# Altium project PLWD_Schematics.PrjPcb (part 1 of 3)
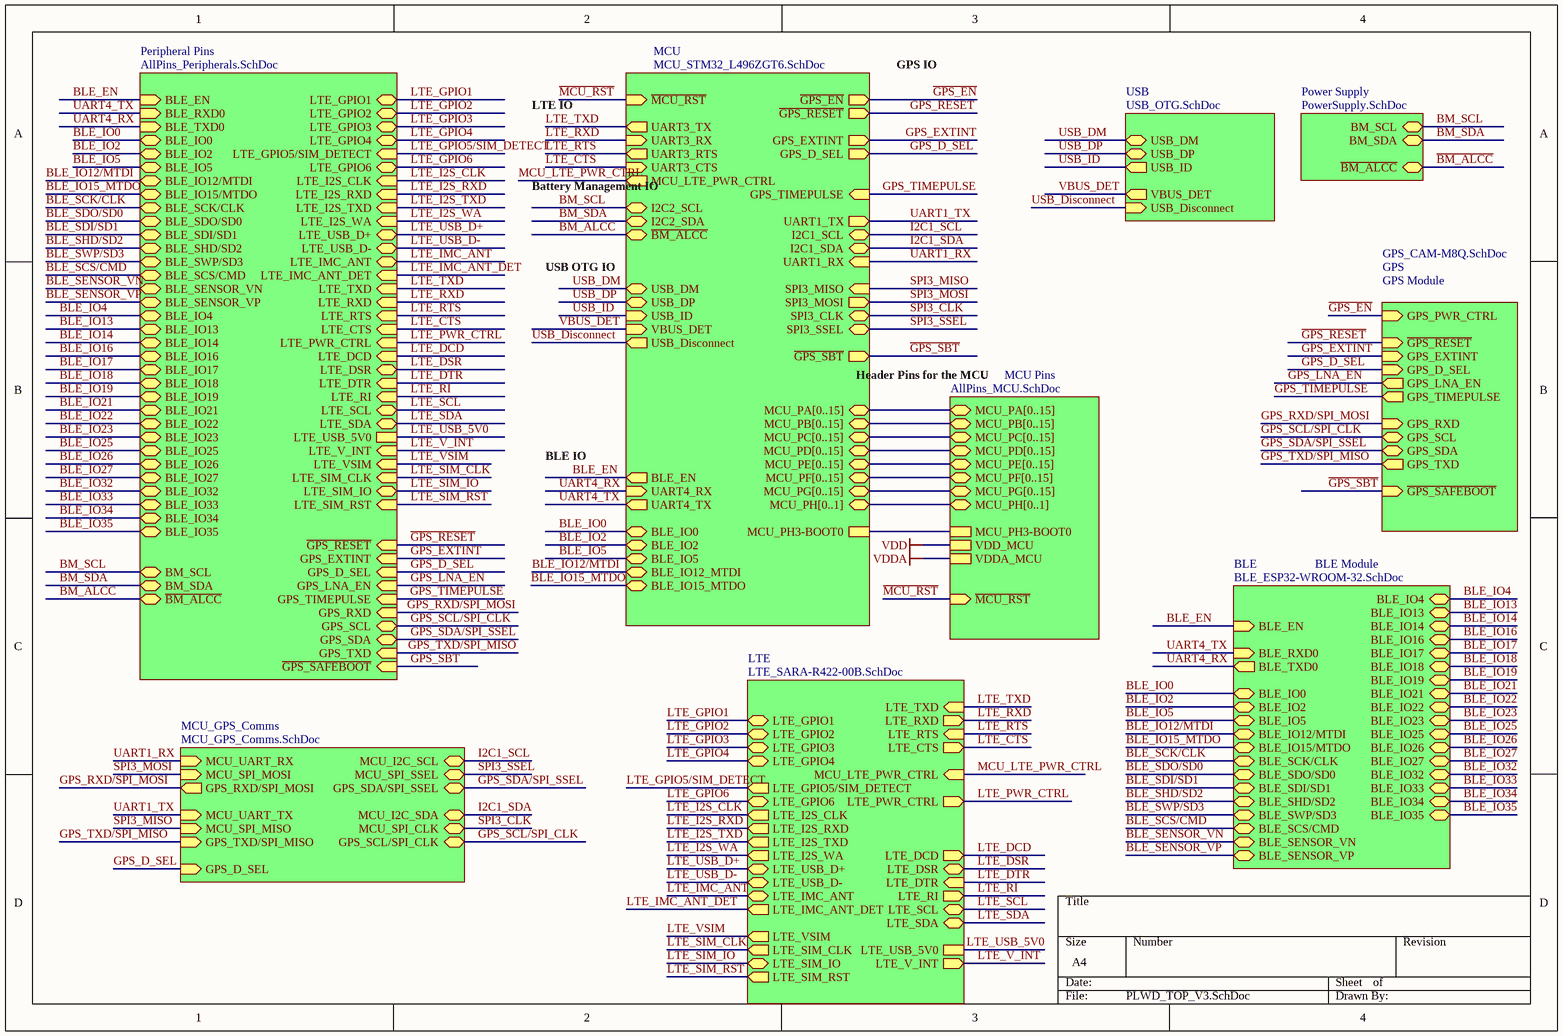
[diagram p0: PLWD_TOP_V3.SchDoc]
10 sheets, 146 parts. Net scope: hierarchical (ports join the sheet entries above them; power ports are global).
Board file: PLWD_PCB_6Layer.PcbDoc
Sheets:
  PLWD_TOP_V3.SchDoc
    MCU = MCU_STM32_L496ZGT6.SchDoc
    LTE = LTE_SARA-R422-00B.SchDoc
    GPS = GPS_CAM-M8Q.SchDoc
    BLE = BLE_ESP32-WROOM-32.SchDoc
    Power Supply = PowerSupply.SchDoc
    Peripheral Pins = AllPins_Peripherals.SchDoc
    MCU Pins = AllPins_MCU.SchDoc
    MCU_GPS_Comms = MCU_GPS_Comms.SchDoc
    USB = USB_OTG.SchDoc

## Sheet PLWD_TOP_V3.SchDoc
size A4; SheetNumber: 1; SheetTotal: 10

### Sub-sheets
BLE = BLE_ESP32-WROOM-32.SchDoc: BLE_EN (in), BLE_RXD0 (in), BLE_TXD0 (out), BLE_IO0 (bidir), BLE_IO2 (bidir), BLE_IO5 (bidir), BLE_IO12/MTDI (bidir), BLE_IO15/MTDO (bidir), BLE_SCK/CLK (bidir), BLE_SDO/SD0 (bidir), BLE_SDI/SD1 (bidir), BLE_SHD/SD2 (bidir), BLE_SWP/SD3 (bidir), BLE_SCS/CMD (bidir), BLE_SENSOR_VN (bidir), BLE_SENSOR_VP (bidir), BLE_IO4 (bidir), BLE_IO13 (bidir), BLE_IO14 (bidir), BLE_IO16 (bidir), BLE_IO17 (bidir), BLE_IO18 (bidir), BLE_IO27 (bidir), BLE_IO26 (bidir), BLE_IO25 (bidir), BLE_IO23 (bidir), BLE_IO22 (bidir), BLE_IO21 (bidir), BLE_IO19 (bidir), BLE_IO32 (bidir), BLE_IO33 (bidir), BLE_IO34 (bidir), BLE_IO35 (bidir)
GPS = GPS_CAM-M8Q.SchDoc: GPS_PWR_CTRL (in), ~{GPS_RESET} (in), GPS_EXTINT (in), GPS_D_SEL (in), GPS_LNA_EN (out), GPS_TIMEPULSE (out), GPS_RXD (in), GPS_SCL (bidir), GPS_SDA (bidir), GPS_TXD (out), ~{GPS_SAFEBOOT} (in)
LTE = LTE_SARA-R422-00B.SchDoc: LTE_TXD (in), LTE_RXD (out), LTE_RTS (in), LTE_CTS (out), MCU_LTE_PWR_CTRL (in), LTE_GPIO1 (bidir), LTE_GPIO2 (bidir), LTE_GPIO3 (bidir), LTE_GPIO4 (bidir), LTE_GPIO5/SIM_DETECT (out), LTE_GPIO6 (bidir), LTE_I2S_CLK (out), LTE_I2S_RXD (out), LTE_I2S_TXD (out), LTE_I2S_WA (out), LTE_USB_D- (bidir), LTE_USB_D+ (bidir), LTE_IMC_ANT (bidir), LTE_IMC_ANT_DET (out), LTE_DTR (in), LTE_DSR (bidir), LTE_DCD (out), LTE_RI (out), LTE_SDA (bidir), LTE_SCL (bidir), LTE_USB_5V0, LTE_V_INT (out), LTE_VSIM (out), LTE_SIM_CLK (out), LTE_SIM_IO (bidir), LTE_SIM_RST (out), LTE_PWR_CTRL (out)
MCU = MCU_STM32_L496ZGT6.SchDoc: UART3_TX (out), UART3_RX (in), UART3_RTS (out), UART3_CTS (in), I2C2_SCL (bidir), I2C2_SDA (bidir), MCU_LTE_PWR_CTRL (out), ~{GPS_SBT} (out), UART1_TX (out), UART1_RX (in), GPS_EXTINT (out), I2C1_SCL (bidir), I2C1_SDA (bidir), GPS_TIMEPULSE (in), GPS_D_SEL (out), UART4_RX (in), UART4_TX (out), BLE_IO0 (bidir), BLE_IO2 (bidir), BLE_IO5 (bidir), BLE_IO12_MTDI (bidir), BLE_IO15_MTDO (bidir), ~{BM_ALCC} (bidir), ~{GPS_RESET} (out), BLE_EN (out), ~{GPS_EN} (out), SPI3_MISO (in), SPI3_MOSI (out), SPI3_CLK (bidir), SPI3_SSEL (bidir), USB_DM (bidir), USB_DP (bidir), MCU_PA[0..15] (bidir), MCU_PB[0..15] (bidir), MCU_PC[0..15] (bidir), MCU_PD[0..15] (bidir), MCU_PE[0..15] (bidir), MCU_PF[0..15] (bidir), MCU_PG[0..15] (bidir), MCU_PH3-BOOT0, MCU_PH[0..1] (bidir), ~{MCU_RST} (in), USB_ID (in), VBUS_DET (in), USB_Disconnect (out)
MCU Pins = AllPins_MCU.SchDoc: MCU_PA[0..15] (bidir), MCU_PB[0..15] (bidir), MCU_PC[0..15] (bidir), MCU_PD[0..15] (bidir), MCU_PE[0..15] (bidir), MCU_PF[0..15] (bidir), MCU_PG[0..15] (bidir), MCU_PH[0..1] (bidir), MCU_PH3-BOOT0, VDD_MCU, VDDA_MCU, ~{MCU_RST} (in)
MCU_GPS_Comms = MCU_GPS_Comms.SchDoc: MCU_UART_RX (in), MCU_SPI_MOSI (in), GPS_D_SEL (in), GPS_RXD/SPI_MOSI (out), MCU_UART_TX (in), MCU_SPI_MISO (in), GPS_TXD/SPI_MISO (in), GPS_SDA/SPI_SSEL (bidir), MCU_SPI_SSEL (bidir), MCU_I2C_SCL (bidir), GPS_SCL/SPI_CLK (bidir), MCU_SPI_CLK (bidir), MCU_I2C_SDA (bidir)
Peripheral Pins = AllPins_Peripherals.SchDoc: BLE_EN (in), BLE_RXD0 (in), BLE_TXD0 (in), BLE_IO0 (bidir), BLE_IO2 (bidir), BLE_IO5 (bidir), BLE_IO12/MTDI (bidir), BLE_IO15/MTDO (bidir), BLE_SCK/CLK (bidir), BLE_SDO/SD0 (bidir), BLE_SDI/SD1 (bidir), BLE_SHD/SD2 (bidir), BLE_SWP/SD3 (bidir), BLE_SCS/CMD (bidir), BLE_SENSOR_VN (bidir), BLE_SENSOR_VP (bidir), BLE_IO4 (bidir), BLE_IO13 (bidir), BLE_IO14 (bidir), BLE_IO16 (bidir), BLE_IO17 (bidir), BLE_IO18 (bidir), BLE_IO19 (bidir), BLE_IO21 (bidir), BLE_IO22 (bidir), BLE_IO23 (bidir), BLE_IO25 (bidir), BLE_IO26 (bidir), BLE_IO27 (bidir), BLE_IO32 (bidir), BLE_IO33 (bidir), BLE_IO34 (bidir), BLE_IO35 (bidir), LTE_IMC_ANT_DET (in), LTE_I2S_RXD (in), LTE_I2S_CLK (in), LTE_GPIO6 (bidir), LTE_GPIO5/SIM_DETECT (in), LTE_GPIO4 (bidir), LTE_GPIO3 (bidir), LTE_GPIO2 (bidir), LTE_GPIO1 (bidir), LTE_I2S_TXD (in), LTE_I2S_WA (in), LTE_USB_D+ (bidir), LTE_USB_D- (bidir), LTE_IMC_ANT (bidir), LTE_TXD (in), LTE_RXD (in), LTE_RTS (in), LTE_CTS (in), LTE_PWR_CTRL (in), LTE_DCD (in), LTE_DSR (bidir), LTE_DTR (in), LTE_RI (in), ~{GPS_RESET} (in), GPS_EXTINT (in), GPS_D_SEL (in), GPS_LNA_EN (in), GPS_TIMEPULSE (in), GPS_RXD (in), GPS_TXD (in), GPS_SCL (bidir), GPS_SDA (bidir), BM_SCL (bidir), BM_SDA (bidir), ~{BM_ALCC} (bidir), ~{GPS_SAFEBOOT} (in), LTE_USB_5V0, LTE_SDA (bidir), LTE_SCL (bidir), LTE_V_INT (in), LTE_SIM_CLK (in), LTE_VSIM (in), LTE_SIM_RST (in), LTE_SIM_IO (bidir)
Power Supply = PowerSupply.SchDoc: BM_SCL (bidir), BM_SDA (bidir), ~{BM_ALCC} (bidir)
USB = USB_OTG.SchDoc: USB_DM (bidir), USB_DP (bidir), USB_ID (out), VBUS_DET (out), USB_Disconnect (in)

### Nets
~{BM_ALCC}: sheet MCU/~{BM_ALCC}, sheet Power Supply/~{BM_ALCC}, sheet Peripheral Pins/~{BM_ALCC}
BLE_EN: sheet MCU/BLE_EN, sheet BLE/BLE_EN, sheet Peripheral Pins/BLE_EN
BLE_IO0: sheet MCU/BLE_IO0, sheet BLE/BLE_IO0, sheet Peripheral Pins/BLE_IO0
BLE_IO2: sheet MCU/BLE_IO2, sheet BLE/BLE_IO2, sheet Peripheral Pins/BLE_IO2
BLE_IO4: sheet BLE/BLE_IO4, sheet Peripheral Pins/BLE_IO4
BLE_IO5: sheet MCU/BLE_IO5, sheet BLE/BLE_IO5, sheet Peripheral Pins/BLE_IO5
BLE_IO12/MTDI: sheet MCU/BLE_IO12_MTDI, sheet BLE/BLE_IO12/MTDI, sheet Peripheral Pins/BLE_IO12/MTDI
BLE_IO13: sheet BLE/BLE_IO13, sheet Peripheral Pins/BLE_IO13
BLE_IO14: sheet BLE/BLE_IO14, sheet Peripheral Pins/BLE_IO14
BLE_IO15_MTDO: sheet MCU/BLE_IO15_MTDO, sheet BLE/BLE_IO15/MTDO, sheet Peripheral Pins/BLE_IO15/MTDO
BLE_IO16: sheet BLE/BLE_IO16, sheet Peripheral Pins/BLE_IO16
BLE_IO17: sheet BLE/BLE_IO17, sheet Peripheral Pins/BLE_IO17
BLE_IO18: sheet BLE/BLE_IO18, sheet Peripheral Pins/BLE_IO18
BLE_IO19: sheet BLE/BLE_IO19, sheet Peripheral Pins/BLE_IO19
BLE_IO21: sheet BLE/BLE_IO21, sheet Peripheral Pins/BLE_IO21
BLE_IO22: sheet BLE/BLE_IO22, sheet Peripheral Pins/BLE_IO22
BLE_IO23: sheet BLE/BLE_IO23, sheet Peripheral Pins/BLE_IO23
BLE_IO25: sheet BLE/BLE_IO25, sheet Peripheral Pins/BLE_IO25
BLE_IO26: sheet BLE/BLE_IO26, sheet Peripheral Pins/BLE_IO26
BLE_IO27: sheet BLE/BLE_IO27, sheet Peripheral Pins/BLE_IO27
BLE_IO32: sheet BLE/BLE_IO32, sheet Peripheral Pins/BLE_IO32
BLE_IO33: sheet BLE/BLE_IO33, sheet Peripheral Pins/BLE_IO33
BLE_IO34: sheet BLE/BLE_IO34, sheet Peripheral Pins/BLE_IO34
BLE_IO35: sheet BLE/BLE_IO35, sheet Peripheral Pins/BLE_IO35
BLE_SCK/CLK: sheet BLE/BLE_SCK/CLK, sheet Peripheral Pins/BLE_SCK/CLK
BLE_SCS/CMD: sheet BLE/BLE_SCS/CMD, sheet Peripheral Pins/BLE_SCS/CMD
BLE_SDI/SD1: sheet BLE/BLE_SDI/SD1, sheet Peripheral Pins/BLE_SDI/SD1
BLE_SDO/SD0: sheet BLE/BLE_SDO/SD0, sheet Peripheral Pins/BLE_SDO/SD0
BLE_SENSOR_VN: sheet BLE/BLE_SENSOR_VN, sheet Peripheral Pins/BLE_SENSOR_VN
BLE_SENSOR_VP: sheet BLE/BLE_SENSOR_VP, sheet Peripheral Pins/BLE_SENSOR_VP
BLE_SHD/SD2: sheet BLE/BLE_SHD/SD2, sheet Peripheral Pins/BLE_SHD/SD2
BLE_SWP/SD3: sheet BLE/BLE_SWP/SD3, sheet Peripheral Pins/BLE_SWP/SD3
BM_SCL: sheet MCU/I2C2_SCL, sheet Power Supply/BM_SCL, sheet Peripheral Pins/BM_SCL
BM_SDA: sheet MCU/I2C2_SDA, sheet Power Supply/BM_SDA, sheet Peripheral Pins/BM_SDA
~{GPS_EN}: sheet MCU/~{GPS_EN}, sheet GPS/GPS_PWR_CTRL
~{GPS_RESET}: sheet MCU/~{GPS_RESET}, sheet GPS/~{GPS_RESET}, sheet Peripheral Pins/~{GPS_RESET}
~{GPS_SBT}: sheet MCU/~{GPS_SBT}, sheet GPS/~{GPS_SAFEBOOT}, sheet Peripheral Pins/~{GPS_SAFEBOOT}
GPS_D_SEL: sheet MCU/GPS_D_SEL, sheet GPS/GPS_D_SEL, sheet Peripheral Pins/GPS_D_SEL, sheet MCU_GPS_Comms/GPS_D_SEL
GPS_EXTINT: sheet MCU/GPS_EXTINT, sheet GPS/GPS_EXTINT, sheet Peripheral Pins/GPS_EXTINT
GPS_LNA_EN: sheet GPS/GPS_LNA_EN, sheet Peripheral Pins/GPS_LNA_EN
GPS_RXD/SPI_MOSI: sheet GPS/GPS_RXD, sheet Peripheral Pins/GPS_RXD, sheet MCU_GPS_Comms/GPS_RXD/SPI_MOSI
GPS_SCL/SPI_CLK: sheet GPS/GPS_SCL, sheet Peripheral Pins/GPS_SCL, sheet MCU_GPS_Comms/GPS_SCL/SPI_CLK
GPS_SDA/SPI_SSEL: sheet GPS/GPS_SDA, sheet Peripheral Pins/GPS_SDA, sheet MCU_GPS_Comms/GPS_SDA/SPI_SSEL
GPS_TIMEPULSE: sheet MCU/GPS_TIMEPULSE, sheet GPS/GPS_TIMEPULSE, sheet Peripheral Pins/GPS_TIMEPULSE
GPS_TXD/SPI_MISO: sheet GPS/GPS_TXD, sheet Peripheral Pins/GPS_TXD, sheet MCU_GPS_Comms/GPS_TXD/SPI_MISO
I2C1_SCL: sheet MCU/I2C1_SCL, sheet MCU_GPS_Comms/MCU_I2C_SCL
I2C1_SDA: sheet MCU/I2C1_SDA, sheet MCU_GPS_Comms/MCU_I2C_SDA
LTE_CTS: sheet MCU/UART3_CTS, sheet LTE/LTE_CTS, sheet Peripheral Pins/LTE_CTS
LTE_DCD: sheet LTE/LTE_DCD, sheet Peripheral Pins/LTE_DCD
LTE_DSR: sheet LTE/LTE_DSR, sheet Peripheral Pins/LTE_DSR
LTE_DTR: sheet LTE/LTE_DTR, sheet Peripheral Pins/LTE_DTR
LTE_GPIO1: sheet LTE/LTE_GPIO1, sheet Peripheral Pins/LTE_GPIO1
LTE_GPIO2: sheet LTE/LTE_GPIO2, sheet Peripheral Pins/LTE_GPIO2
LTE_GPIO3: sheet LTE/LTE_GPIO3, sheet Peripheral Pins/LTE_GPIO3
LTE_GPIO4: sheet LTE/LTE_GPIO4, sheet Peripheral Pins/LTE_GPIO4
LTE_GPIO5/SIM_DETECT: sheet LTE/LTE_GPIO5/SIM_DETECT, sheet Peripheral Pins/LTE_GPIO5/SIM_DETECT
LTE_GPIO6: sheet LTE/LTE_GPIO6, sheet Peripheral Pins/LTE_GPIO6
LTE_I2S_CLK: sheet LTE/LTE_I2S_CLK, sheet Peripheral Pins/LTE_I2S_CLK
LTE_I2S_RXD: sheet LTE/LTE_I2S_RXD, sheet Peripheral Pins/LTE_I2S_RXD
LTE_I2S_TXD: sheet LTE/LTE_I2S_TXD, sheet Peripheral Pins/LTE_I2S_TXD
LTE_I2S_WA: sheet LTE/LTE_I2S_WA, sheet Peripheral Pins/LTE_I2S_WA
LTE_IMC_ANT: sheet LTE/LTE_IMC_ANT, sheet Peripheral Pins/LTE_IMC_ANT  [project net IMC_ANT]
LTE_IMC_ANT_DET: sheet LTE/LTE_IMC_ANT_DET, sheet Peripheral Pins/LTE_IMC_ANT_DET  [project net IMP_ANT_DET]
LTE_PWR_CTRL: sheet LTE/LTE_PWR_CTRL, sheet Peripheral Pins/LTE_PWR_CTRL
LTE_RI: sheet LTE/LTE_RI, sheet Peripheral Pins/LTE_RI
LTE_RTS: sheet MCU/UART3_RTS, sheet LTE/LTE_RTS, sheet Peripheral Pins/LTE_RTS
LTE_RXD: sheet MCU/UART3_RX, sheet LTE/LTE_RXD, sheet Peripheral Pins/LTE_RXD
LTE_SCL: sheet LTE/LTE_SCL, sheet Peripheral Pins/LTE_SCL
LTE_SDA: sheet LTE/LTE_SDA, sheet Peripheral Pins/LTE_SDA
LTE_SIM_CLK: sheet LTE/LTE_SIM_CLK, sheet Peripheral Pins/LTE_SIM_CLK
LTE_SIM_IO: sheet LTE/LTE_SIM_IO, sheet Peripheral Pins/LTE_SIM_IO
LTE_SIM_RST: sheet LTE/LTE_SIM_RST, sheet Peripheral Pins/LTE_SIM_RST
LTE_TXD: sheet MCU/UART3_TX, sheet LTE/LTE_TXD, sheet Peripheral Pins/LTE_TXD
LTE_USB_5V0: sheet LTE/LTE_USB_5V0, sheet Peripheral Pins/LTE_USB_5V0
LTE_USB_D+: sheet LTE/LTE_USB_D+, sheet Peripheral Pins/LTE_USB_D+
LTE_USB_D-: sheet LTE/LTE_USB_D-, sheet Peripheral Pins/LTE_USB_D-
LTE_V_INT: sheet LTE/LTE_V_INT, sheet Peripheral Pins/LTE_V_INT  [project net 1V8]
LTE_VSIM: sheet LTE/LTE_VSIM, sheet Peripheral Pins/LTE_VSIM
~{MCU_RST}: sheet MCU/~{MCU_RST}, sheet MCU Pins/~{MCU_RST}
MCU_LTE_PWR_CTRL: sheet MCU/MCU_LTE_PWR_CTRL, sheet LTE/MCU_LTE_PWR_CTRL
MCU_PH3-BOOT0: sheet MCU/MCU_PH3-BOOT0, sheet MCU Pins/MCU_PH3-BOOT0
SPI3_CLK: sheet MCU/SPI3_CLK, sheet MCU_GPS_Comms/MCU_SPI_CLK  [project net MCU_PG9]
SPI3_MISO: sheet MCU/SPI3_MISO, sheet MCU_GPS_Comms/MCU_SPI_MISO  [project net MCU_PB4]
SPI3_MOSI: sheet MCU/SPI3_MOSI, sheet MCU_GPS_Comms/MCU_SPI_MOSI  [project net MCU_PB5]
SPI3_SSEL: sheet MCU/SPI3_SSEL, sheet MCU_GPS_Comms/MCU_SPI_SSEL  [project net MCU_PA15]
UART1_RX: sheet MCU/UART1_RX, sheet MCU_GPS_Comms/MCU_UART_RX  [project net MCU_PB7]
UART1_TX: sheet MCU/UART1_TX, sheet MCU_GPS_Comms/MCU_UART_TX  [project net MCU_PB6]
UART4_RX: sheet MCU/UART4_RX, sheet BLE/BLE_TXD0, sheet Peripheral Pins/BLE_TXD0  [project net BLE_TXD0]
UART4_TX: sheet MCU/UART4_TX, sheet BLE/BLE_RXD0, sheet Peripheral Pins/BLE_RXD0  [project net BLE_RXD0]
USB_Disconnect: sheet MCU/USB_Disconnect, sheet USB/USB_Disconnect  [project net MCU_PG6]
USB_DM: sheet MCU/USB_DM, sheet USB/USB_DM  [project net MCU_PA11]
USB_DP: sheet MCU/USB_DP, sheet USB/USB_DP  [project net MCU_PA12]
USB_ID: sheet MCU/USB_ID, sheet USB/USB_ID  [project net MCU_PA10]
VBUS_DET: sheet MCU/VBUS_DET, sheet USB/VBUS_DET  [project net MCU_PG5]

### Buses and harness runs
bus sheet MCU Pins/MCU_PA[0..15] = sheet MCU/MCU_PA[0..15]
bus sheet MCU Pins/MCU_PB[0..15] = sheet MCU/MCU_PB[0..15]
bus sheet MCU Pins/MCU_PC[0..15] = sheet MCU/MCU_PC[0..15]
bus sheet MCU Pins/MCU_PD[0..15] = sheet MCU/MCU_PD[0..15]
bus sheet MCU Pins/MCU_PE[0..15] = sheet MCU/MCU_PE[0..15]
bus sheet MCU Pins/MCU_PF[0..15] = sheet MCU/MCU_PF[0..15]
bus sheet MCU Pins/MCU_PG[0..15] = sheet MCU/MCU_PG[0..15]
bus sheet MCU Pins/MCU_PH[0..1] = sheet MCU/MCU_PH[0..1]

### Notes on the sheet
- LTE IO
- GPS IO
- Battery Management IO
- USB OTG IO
- GPS Module
- Header Pins for the MCU
- BLE IO
- BLE Module

## Sheet MCU_STM32_L496ZGT6.SchDoc
size A4; SheetNumber: 3; SheetTotal: 10
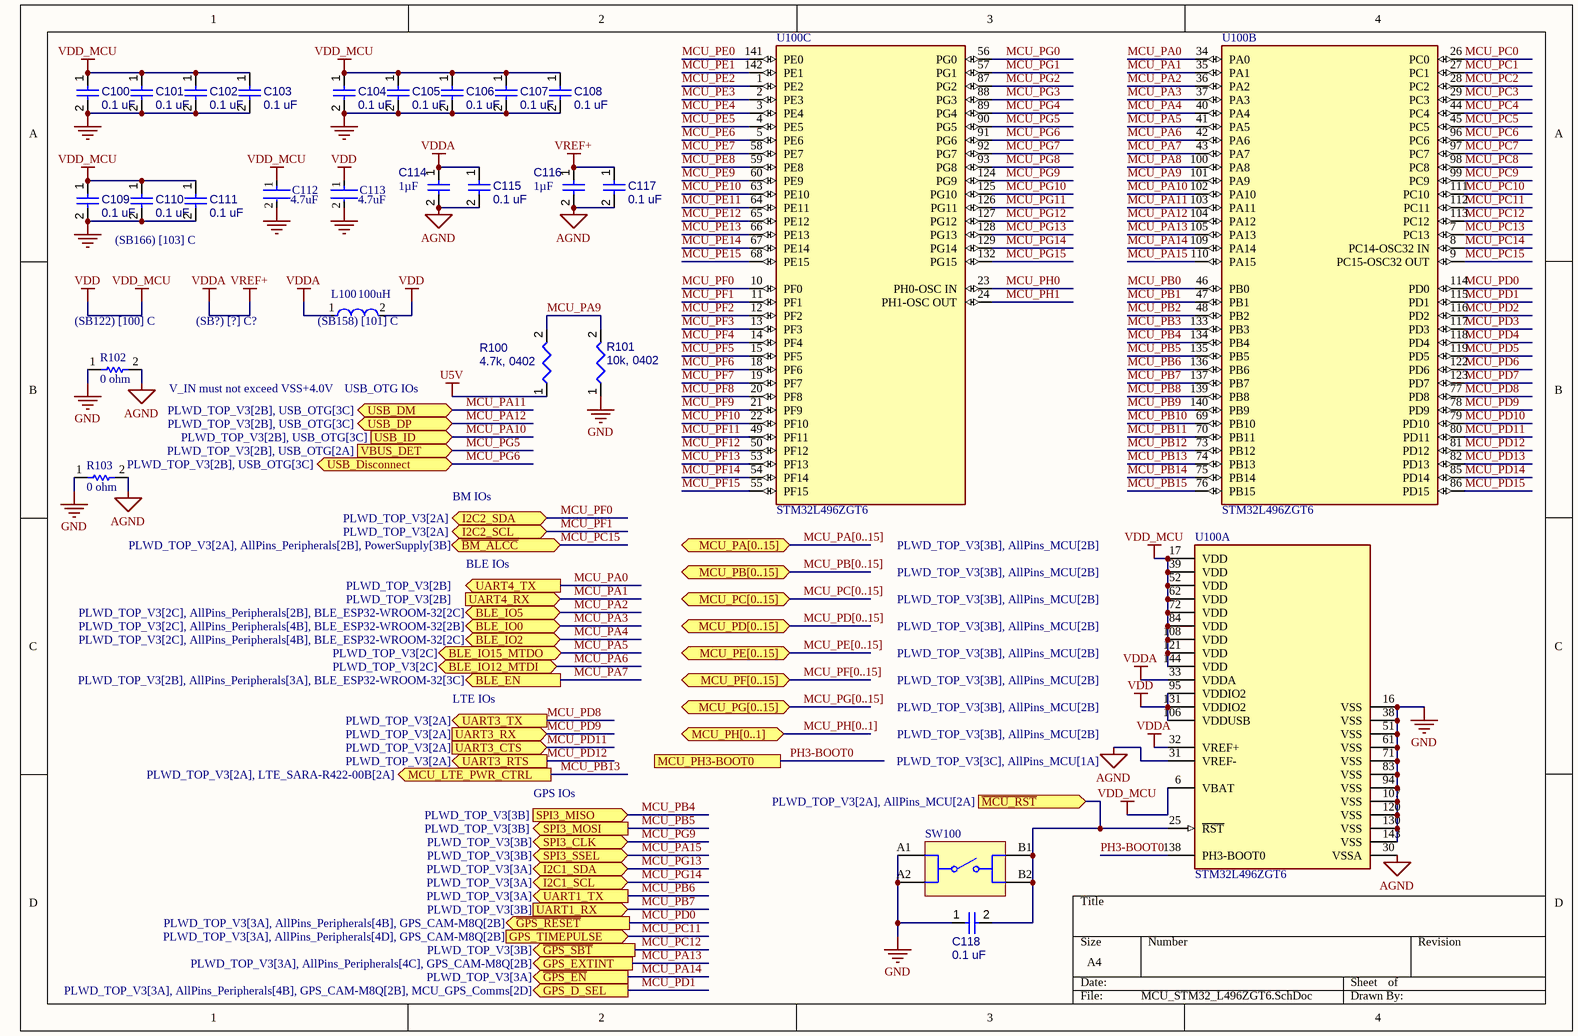
[diagram p1: MCU_STM32_L496ZGT6.SchDoc]

### Parts
C100  0.1 uF  [CAPC1005X56X25LL10T15]
C101  0.1 uF  [CAPC1005X56X25LL10T15]
C102  0.1 uF  [CAPC1005X56X25LL10T15]
C103  0.1 uF  [CAPC1005X56X25LL10T15]
C104  0.1 uF  [CAPC1005X56X25LL10T15]
C105  0.1 uF  [CAPC1005X56X25LL10T15]
C106  0.1 uF  [CAPC1005X56X25LL10T15]
C107  0.1 uF  [CAPC1005X56X25LL10T15]
C108  0.1 uF  [CAPC1005X56X25LL10T15]
C109  0.1 uF  [CAPC1005X56X25LL10T15]
C110  0.1 uF  [CAPC1005X56X25LL10T15]
C111  0.1 uF  [CAPC1005X56X25LL10T15]
C112  Capacitance: 4.7uF  [FP-CL282-IPC_C]  (hidden comment: CL05A475MP5NRNC)
C113  Capacitance: 4.7uF  [FP-CL282-IPC_C]  (hidden comment: CL05A475MP5NRNC)
C114  value 1µF  [CAPC0402(1005)60_L]  (hidden comment: Capacitor 1µF +/-20% 10V 0402)
C115  0.1 uF  [CAPC1005X56X25LL10T15]
C116  value 1µF  [CAPC0402(1005)60_L]  (hidden comment: Capacitor 1µF +/-20% 10V 0402)
C117  0.1 uF  [CAPC1005X56X25LL10T15]
C118  0.1 uF  [CAPC1005X56X25LL10T15]
L100  100uH  [FP-MLZ2012-1_25-IPC_C]
R100  4.7k, 0402  [RESC0402(1005)_L]
R101  10k, 0402  [RESC1005X40X25ML05T05]
R102  0 ohm  [RESC1005X40X25LL05T10]
R103  0 ohm  [RESC1005X40X25LL05T10]
SW100  430182070816  [WS-TASV_L6W6H7_4301x20708x6]  (value not drawn)
U100  STM32L496ZGT6  [FP-LQFP144-1A-MFG]  (parts A,B,C of 3)

### Ports
BLE_EN (out, see PLWD_TOP_V3[2B], AllPins_Peripherals[3A], BLE_ESP32-WROOM-32[3C]), BLE_IO0 (bidir, see PLWD_TOP_V3[2C], AllPins_Peripherals[4B], BLE_ESP32-WROOM-32[2B]), BLE_IO2 (bidir, see PLWD_TOP_V3[2C], AllPins_Peripherals[4B], BLE_ESP32-WROOM-32[2C]), BLE_IO5 (bidir, see PLWD_TOP_V3[2C], AllPins_Peripherals[2B], BLE_ESP32-WROOM-32[2C]), BLE_IO12_MTDI (bidir, see PLWD_TOP_V3[2C]), BLE_IO15_MTDO (bidir, see PLWD_TOP_V3[2C]), GPS_D_SEL (out, see PLWD_TOP_V3[3A], AllPins_Peripherals[4B], GPS_CAM-M8Q[2B], MCU_GPS_Comms[2D]), GPS_EXTINT (out, see PLWD_TOP_V3[3A], AllPins_Peripherals[4C], GPS_CAM-M8Q[2B]), GPS_TIMEPULSE (in, see PLWD_TOP_V3[3A], AllPins_Peripherals[4D], GPS_CAM-M8Q[2B]), I2C1_SCL (bidir, see PLWD_TOP_V3[3A]), I2C1_SDA (bidir, see PLWD_TOP_V3[3A]), I2C2_SCL (bidir, see PLWD_TOP_V3[2A]), I2C2_SDA (bidir, see PLWD_TOP_V3[2A]), MCU_LTE_PWR_CTRL (out, see PLWD_TOP_V3[2A], LTE_SARA-R422-00B[2A]), MCU_PA[0..15] (bidir, see PLWD_TOP_V3[3B], AllPins_MCU[2B]), MCU_PB[0..15] (bidir, see PLWD_TOP_V3[3B], AllPins_MCU[2B]), MCU_PC[0..15] (bidir, see PLWD_TOP_V3[3B], AllPins_MCU[2B]), MCU_PD[0..15] (bidir, see PLWD_TOP_V3[3B], AllPins_MCU[2B]), MCU_PE[0..15] (bidir, see PLWD_TOP_V3[3B], AllPins_MCU[2B]), MCU_PF[0..15] (bidir, see PLWD_TOP_V3[3B], AllPins_MCU[2B]), MCU_PG[0..15] (bidir, see PLWD_TOP_V3[3B], AllPins_MCU[2B]), MCU_PH3-BOOT0 (see PLWD_TOP_V3[3C], AllPins_MCU[1A]), MCU_PH[0..1] (bidir, see PLWD_TOP_V3[3B], AllPins_MCU[2B]), SPI3_CLK (bidir, see PLWD_TOP_V3[3B]), SPI3_MISO (in, see PLWD_TOP_V3[3B]), SPI3_MOSI (out, see PLWD_TOP_V3[3B]), SPI3_SSEL (bidir, see PLWD_TOP_V3[3B]), UART1_RX (in, see PLWD_TOP_V3[3B]), UART1_TX (out, see PLWD_TOP_V3[3A]), UART3_CTS (in, see PLWD_TOP_V3[2A]), UART3_RTS (out, see PLWD_TOP_V3[2A]), UART3_RX (in, see PLWD_TOP_V3[2A]), UART3_TX (out, see PLWD_TOP_V3[2A]), UART4_RX (in, see PLWD_TOP_V3[2B]), UART4_TX (out, see PLWD_TOP_V3[2B]), USB_Disconnect (bidir, see PLWD_TOP_V3[2B], USB_OTG[3C]), USB_DM (bidir, see PLWD_TOP_V3[2B], USB_OTG[3C]), USB_DP (bidir, see PLWD_TOP_V3[2B], USB_OTG[3C]), USB_ID (in, see PLWD_TOP_V3[2B], USB_OTG[3C]), VBUS_DET (in, see PLWD_TOP_V3[2B], USB_OTG[2A]), ~{BM_ALCC} (bidir, see PLWD_TOP_V3[2A], AllPins_Peripherals[2B], PowerSupply[3B]), ~{GPS_EN} (out, see PLWD_TOP_V3[3A]), ~{GPS_RESET} (out, see PLWD_TOP_V3[3A], AllPins_Peripherals[4B], GPS_CAM-M8Q[2B]), ~{GPS_SBT} (out, see PLWD_TOP_V3[3B]), ~{MCU_RST} (in, see PLWD_TOP_V3[2A], AllPins_MCU[2A])

### Nets
AGND: C114.2 C115.2 C116.2 C117.2 R102.2 R103.2 U100.30(VSSA) U100.31(VREF-)
GND: C100.2 C101.2 C102.2 C103.2 C104.2 C105.2 C106.2 C107.2 C108.2 C109.2 C110.2 C111.2 C112.2 C113.2 C118.1 R101.1 R102.1 R103.1 SW100.A1 SW100.A2 U100.16(VSS) U100.38(VSS) U100.51(VSS) U100.61(VSS) U100.71(VSS) U100.83(VSS) U100.94(VSS) U100.107(VSS) U100.120(VSS) U100.130(VSS) U100.143(VSS)
U5V: R100.1
VDD_MCU: C100.1 C101.1 C102.1 C103.1 C104.1 C105.1 C106.1 C107.1 C108.1 C109.1 C110.1 C111.1 C112.1 C113.1 L100.2 U100.6(VBAT) U100.17(VDD) U100.39(VDD) U100.52(VDD) U100.62(VDD) U100.72(VDD) U100.84(VDD) U100.95(VDDIO2) U100.106(VDDUSB) U100.108(VDD) U100.121(VDD) U100.131(VDDIO2) U100.144(VDD)  [also labelled VDD]
VDDA: C114.1 C115.1 C116.1 C117.1 L100.1 U100.32(VREF+) U100.33(VDDA)  [also labelled VREF+]  [project net VDDA_MCU]
~{MCU_RST}: C118.2 SW100.B1 SW100.B2 U100.25(~{RST}) ; port ~{MCU_RST}
MCU_PA0: U100.34(PA0) ; port UART4_TX  [project net BLE_RXD0]
MCU_PA1: U100.35(PA1) ; port UART4_RX  [project net BLE_TXD0]
MCU_PA2: U100.36(PA2) ; port BLE_IO5  [project net BLE_IO5]
MCU_PA3: U100.37(PA3) ; port BLE_IO0  [project net BLE_IO0]
MCU_PA4: U100.40(PA4) ; port BLE_IO2  [project net BLE_IO2]
MCU_PA5: U100.41(PA5) ; port BLE_IO15_MTDO  [project net BLE_IO15_MTDO]
MCU_PA6: U100.42(PA6) ; port BLE_IO12_MTDI  [project net BLE_IO12/MTDI]
MCU_PA7: U100.43(PA7) ; port BLE_EN  [project net BLE_EN]
MCU_PA8: U100.100(PA8)
MCU_PA9: R100.2 R101.2 U100.101(PA9)
MCU_PA10: U100.102(PA10) ; port USB_ID
MCU_PA11: U100.103(PA11) ; port USB_DM
MCU_PA12: U100.104(PA12) ; port USB_DP
MCU_PA13: U100.105(PA13) ; port GPS_EXTINT  [project net GPS_EXTINT]
MCU_PA14: U100.109(PA14) ; port ~{GPS_EN}  [project net ~{GPS_EN}]
MCU_PA15: U100.110(PA15) ; port SPI3_SSEL
MCU_PB0: U100.46(PB0)
MCU_PB1: U100.47(PB1)
MCU_PB2: U100.48(PB2)
MCU_PB3: U100.133(PB3)
MCU_PB4: U100.134(PB4) ; port SPI3_MISO
MCU_PB5: U100.135(PB5) ; port SPI3_MOSI
MCU_PB6: U100.136(PB6) ; port UART1_TX
MCU_PB7: U100.137(PB7) ; port UART1_RX
MCU_PB8: U100.139(PB8)
MCU_PB9: U100.140(PB9)
MCU_PB10: U100.69(PB10)
MCU_PB11: U100.70(PB11)
MCU_PB12: U100.73(PB12)
MCU_PB13: U100.74(PB13) ; port MCU_LTE_PWR_CTRL  [project net MCU_LTE_PWR_CTRL]
MCU_PB14: U100.75(PB14)
MCU_PB15: U100.76(PB15)
MCU_PC0: U100.26(PC0)
MCU_PC1: U100.27(PC1)
MCU_PC2: U100.28(PC2)
MCU_PC3: U100.29(PC3)
MCU_PC4: U100.44(PC4)
MCU_PC5: U100.45(PC5)
MCU_PC6: U100.96(PC6)
MCU_PC7: U100.97(PC7)
MCU_PC8: U100.98(PC8)
MCU_PC9: U100.99(PC9)
MCU_PC10: U100.111(PC10)
MCU_PC11: U100.112(PC11) ; port GPS_TIMEPULSE  [project net GPS_TIMEPULSE]
MCU_PC12: U100.113(PC12) ; port ~{GPS_SBT}  [project net ~{GPS_SBT}]
MCU_PC13: U100.7(PC13)
MCU_PC14: U100.8(PC14-OSC32_IN)
MCU_PC15: U100.9(PC15-OSC32_OUT) ; port ~{BM_ALCC}  [project net ~{BM_ALCC}]
MCU_PD0: U100.114(PD0) ; port ~{GPS_RESET}  [project net ~{GPS_RESET}]
MCU_PD1: U100.115(PD1) ; port GPS_D_SEL  [project net GPS_D_SEL]
MCU_PD2: U100.116(PD2)
MCU_PD3: U100.117(PD3)
MCU_PD4: U100.118(PD4)
MCU_PD5: U100.119(PD5)
MCU_PD6: U100.122(PD6)
MCU_PD7: U100.123(PD7)
MCU_PD8: U100.77(PD8) ; port UART3_TX  [project net LTE_TXD]
MCU_PD9: U100.78(PD9) ; port UART3_RX  [project net LTE_RXD]
MCU_PD10: U100.79(PD10)
MCU_PD11: U100.80(PD11) ; port UART3_CTS  [project net LTE_CTS]
MCU_PD12: U100.81(PD12) ; port UART3_RTS  [project net LTE_RTS]
MCU_PD13: U100.82(PD13)
MCU_PD14: U100.85(PD14)
MCU_PD15: U100.86(PD15)
MCU_PE0: U100.141(PE0)
MCU_PE1: U100.142(PE1)
MCU_PE2: U100.1(PE2)
MCU_PE3: U100.2(PE3)
MCU_PE4: U100.3(PE4)
MCU_PE5: U100.4(PE5)
MCU_PE6: U100.5(PE6)
MCU_PE7: U100.58(PE7)
MCU_PE8: U100.59(PE8)
MCU_PE9: U100.60(PE9)
MCU_PE10: U100.63(PE10)
MCU_PE11: U100.64(PE11)
MCU_PE12: U100.65(PE12)
MCU_PE13: U100.66(PE13)
MCU_PE14: U100.67(PE14)
MCU_PE15: U100.68(PE15)
MCU_PF0: U100.10(PF0) ; port I2C2_SDA  [project net BM_SDA]
MCU_PF1: U100.11(PF1) ; port I2C2_SCL  [project net BM_SCL]
MCU_PF2: U100.12(PF2)
MCU_PF3: U100.13(PF3)
MCU_PF4: U100.14(PF4)
MCU_PF5: U100.15(PF5)
MCU_PF6: U100.18(PF6)
MCU_PF7: U100.19(PF7)
MCU_PF8: U100.20(PF8)
MCU_PF9: U100.21(PF9)
MCU_PF10: U100.22(PF10)
MCU_PF11: U100.49(PF11)
MCU_PF12: U100.50(PF12)
MCU_PF13: U100.53(PF13)
MCU_PF14: U100.54(PF14)
MCU_PF15: U100.55(PF15)
MCU_PG0: U100.56(PG0)
MCU_PG1: U100.57(PG1)
MCU_PG2: U100.87(PG2)
MCU_PG3: U100.88(PG3)
MCU_PG4: U100.89(PG4)
MCU_PG5: U100.90(PG5) ; port VBUS_DET
MCU_PG6: U100.91(PG6) ; port USB_Disconnect
MCU_PG7: U100.92(PG7)
MCU_PG8: U100.93(PG8)
MCU_PG9: U100.124(PG9) ; port SPI3_CLK
MCU_PG10: U100.125(PG10)
MCU_PG11: U100.126(PG11)
MCU_PG12: U100.127(PG12)
MCU_PG13: U100.128(PG13) ; port I2C1_SDA  [project net I2C1_SDA]
MCU_PG14: U100.129(PG14) ; port I2C1_SCL  [project net I2C1_SCL]
MCU_PG15: U100.132(PG15)
MCU_PH0: U100.23(PH0-OSC_IN)
MCU_PH1: U100.24(PH1-OSC_OUT)
PH3-BOOT0: U100.138(PH3-BOOT0) ; port MCU_PH3-BOOT0  [project net MCU_PH3-BOOT0]

### Buses and harness runs
bus MCU_PA[0..15] = port MCU_PA[0..15]
bus MCU_PB[0..15] = port MCU_PB[0..15]
bus MCU_PC[0..15] = port MCU_PC[0..15]
bus MCU_PD[0..15] = port MCU_PD[0..15]
bus MCU_PE[0..15] = port MCU_PE[0..15]
bus MCU_PF[0..15] = port MCU_PF[0..15]
bus MCU_PG[0..15] = port MCU_PG[0..15]
bus MCU_PH[0..1] = port MCU_PH[0..1]

### Notes on the sheet
- (SB166) [103] C
- (near R102) (SB122) [100] C
- (SB?) [?] C?
- (near L100) (SB158) [101] C
- V_IN must not exceed VSS+4.0V
- USB_OTG IOs
- BM IOs
- BLE IOs
- LTE IOs
- GPS IOs

### Library data of the parts
C100-C111 C115 C117 C118 = CMP-001-00001-6: Chip Capacitor, 0.1 uF, +/- 5%, 16 V, 0402 (1005 Metric); Value: 100nF; Capacitor Type: Ceramic; Voltage Rating: 16V; Min Operating Temperature: -55°C; Pins: 2; Case/Package: 0402; Max Operating Temperature: 125°C; Mounting Technology: SM; RoHS Compliant: True; Tolerance: 5%
C112 C113 = CMP-13271-000548-1: Cap Ceramic 4.7uF 10V X5R ±20% SMD 0402 +85°C Paper T/R; Max Operating Temperature: 85°C; Lead Free: Lead Free; Tolerance: 20%; Voltage Rating: 10V; Dielectric: X5R; Width: 0.02inch; Length: 0.039inch; Case/Package: 0402; Min Operating Temperature: -55°C; Packaging: Tape and Reel; Thickness: 0.022inch; Case Code (Imperial): 0402; Package Quantity: 10000; Case Code (Metric): 1005; Mount: Surface Mount
C114 C116 = CMP-001-00063-3: Chip Capacitor, 1µF +/-20%, 10V, 0402, Thickness 0.6 mm; Tolerance: 10%; Mounting Technology: SMT; Max Operating Temperature: 85°C; Voltage Rating: 10V; Pins: 2; Case/Package: 0402; Min Operating Temperature: -55°C
L100 = CMP-08253-000224-1: (MLZ2012N101LT000) / Shielded Multilayer Inductor 100uH ±20% 140mA 4550mΩ SMD 0805; Saturation Current: 30mA; DC Resistance (DCR): 4.55R; Test Frequency: 2MHz; Resistance: 3.5R; Core Material: Ferrite; Max Operating Temperature: 125°C; Shielding: Shielded; RoHS Compliant: Yes; Width: 0.049inch; Inductance: 100uH; Current Rating: 140mA; Lead Free: Lead Free; Case Code (Metric): 2012; Mount: Surface Mount; Case Code (Imperial): 0805; Length: 0.079inch; Tolerance: 20%; Packaging: Tape and Reel; Case/Package: 0805; Height - Seated (Max): 0.057inch; Min Operating Temperature: -55°C; Package Quantity: 2000
R100 = CMP-009-00158-3: Chip Resistor, 4,7 kOhms, +/-1 %, 63 mW, -55 to 155 degC, 0402; Power: 63mW; Tolerance: 1%; Max Operating Temperature: 155°C; Pins: 2; Value: 4.7k; Min Operating Temperature: -55°C; Case/Package: 0402
R101 = CMP-009-00015-5: Chip Resistor, 10 KOhm, +/- 1%, 0.1 W, -55 to 155 degC, 0402 (1005 Metric); Voltage Rating: 50V; Power: 100mW; Case/Package: 0402; Value: 10k; RoHS Compliant: True; Min Operating Temperature: -55°C; Mounting Technology: SM; Tolerance: 1%; Max Operating Temperature: 155°C; Pins: 2
R102 R103 = CMP-2002-06455-1: Manufacturer: Panasonic; Part Number: ERJ-S020R00X
SW100 = CMP-1452-00015-2: NexarPartId: 22866492; Actuator Length: 3.6mm; Actuator Material: Liquid Crystal Polymer, Polymer; Contact Current Rating: 50mA; Contact Resistance: 100mΩ; Illumination Type: Illuminated, Non-Illuminated; Life (Cycles): 1Mcycles; Switch Function: Off-Mom; Switch Travel: 250µm; Throw Configuration: SPST; Voltage Rating (DC): 12V; Color: Black; Contact Material: Stainless Steel, Steel; Contact Plating: Silver; Current Rating: 50mA; Diameter: 3mm; Height: 7mm; Insulation Resistance: 100MΩ; Lead Free: Lead Free; Length: 6.2mm; Max Operating Temperature: 85°C; Mechanical Life: 1Mcycles; Min Operating Temperature: -40°C; Mount: Surface Mount; Packaging: Tape and Reel; REACH SVHC: No SVHC; RoHS: Compliant; Termination: Gull Wing; Voltage Rating: 12V; Width: 6.2mm
U100 = CMP-12105-000038-1: IC MCU 32BIT 1MB FLASH 144LQFP; Manufacturer: STMicroelectronics; Max Supply Voltage: 3.6V; Core Architecture: ARM Cortex-M4; Data Bus Width: 32bits; Number Of I2C Channels: 4; Standoff Height: 0.05mm; Max Junction Temp: +105°C; Number Of I/Os: 115; Number Of Pwm Channels: 28; Number Of Spi Channels: 3; Min Supply Voltage: 1.05V; Number Of Adc Channels: 24; Interface: I2C,SPI,UART,USART,CAN,USB,LIN,IrDA,I2S,Other; Number Of Timers/Counters: 13; Ram Size: 320KBytes; Frequency: 80MHz; Number Of Usb Channels: 1; Number Of Uart Channels: 6; Memory Size: 1MBytes; Temperature: -40°C to +105°C; Category: IC; ComponentLink2URL: https://www.st.com/resource/en/datasheet/stm32l496zg.pdf; Device Class L2: Embedded Processors and Controllers; Automotive: No; Device Class L3: Microcontrollers; Digikey Description: IC MCU 32BIT 1MB FLASH 144LQFP; Device Class L1: Integrated Circuits (ICs); Ambient Temperature Range High: +85°C; Ambient Temperature Range Low: -40°C; Temperature Range Low: -40°C; ComponentLink2Description: Datasheet; Package: LQFP144-1A; Manufacturer Part Number: STM32L496ZGT6; Octopart: https://octopart.com/stm32l496zgt6-stmicroelectronics-80927210; Number Of Cores: 1; Height: 1.6mm; Memory Type: FLASH; Lead Free: Yes; Temperature Range High: +105°C; RoHS: TRUE; Number Of A/D Converters: 3; Ipc Land Pattern Name: QFP50P2200X2200X160-144

## Sheet LTE_SARA-R422-00B.SchDoc
size A4; SheetNumber: 2; SheetTotal: 10
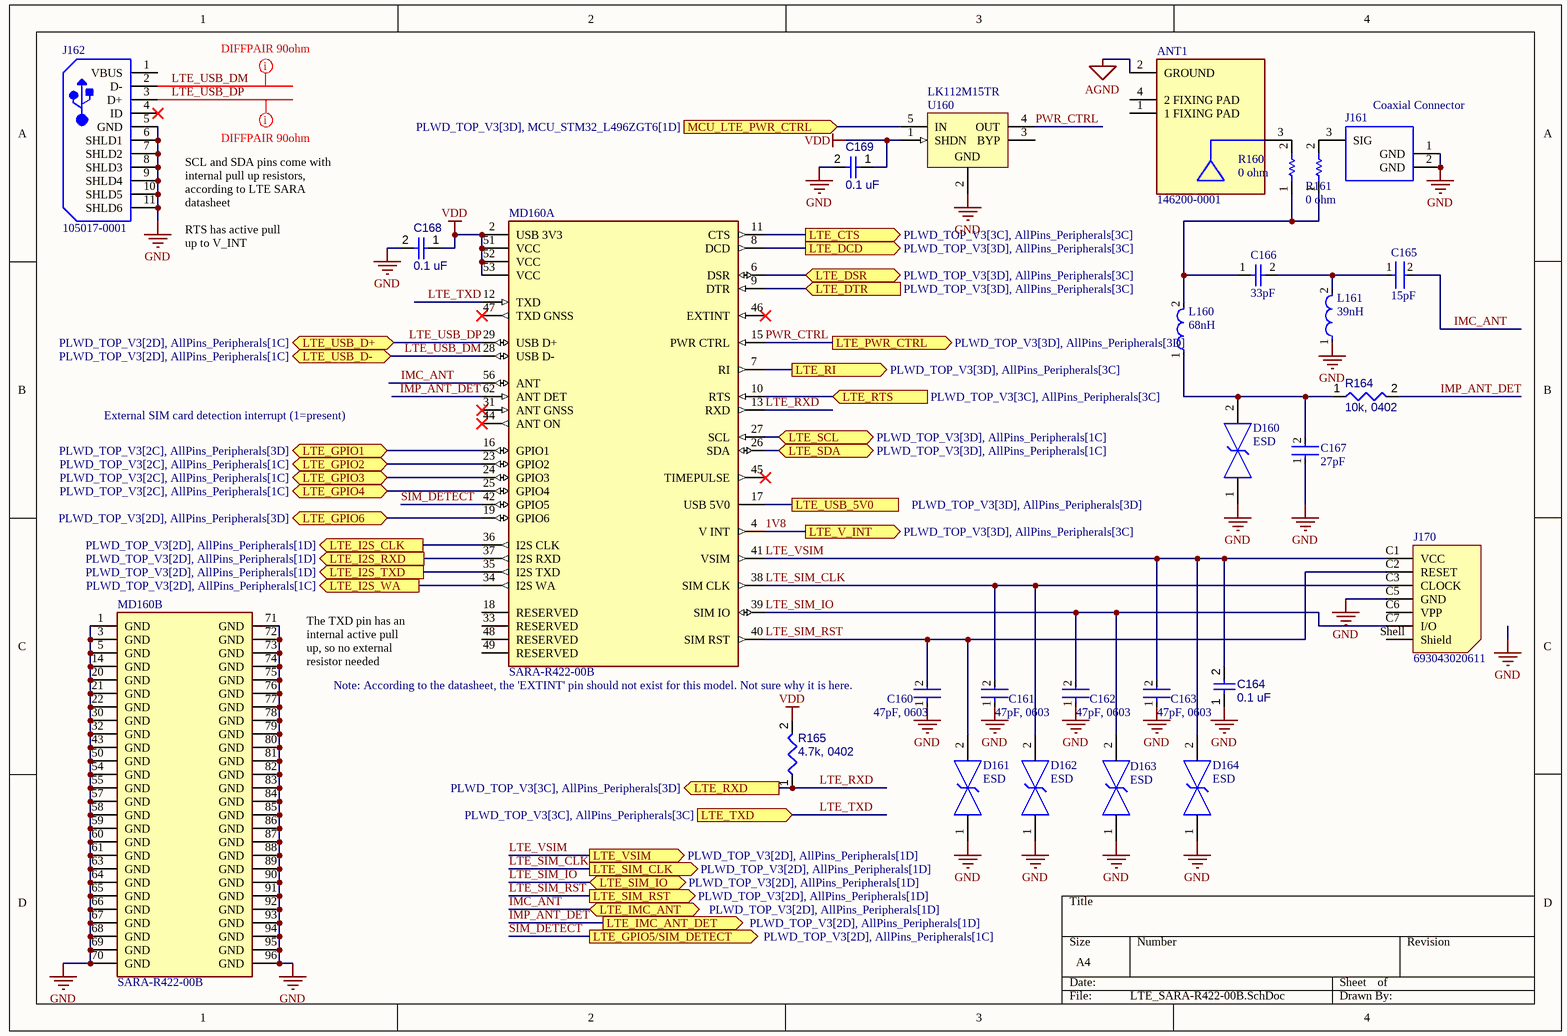
[diagram p2: LTE_SARA-R422-00B.SchDoc]

### Parts
ANT1  146200-0001  [FP-146200-0001-MFG]
C160  47pF, 0603  [FP-C0603C-CF-MFG]
C161  47pF, 0603  [FP-C0603C-CF-MFG]
C162  47pF, 0603  [FP-C0603C-CF-MFG]
C163  47pF, 0603  [FP-C0603C-CF-MFG]
C164  0.1 uF  [CAPC1005X56X25LL10T15]
C165  15pF  [FP-0603-L_1_6_0_15-W_0_81-IPC_B]
C166  33pF  [CAPC1608X90X35NL15T15]
C167  27pF  [FP-C0603C-CF-MFG]
C168  0.1 uF  [CAPC1005X56X25LL10T15]
C169  0.1 uF  [CAPC1005X56X25LL10T15]
D160  ESD  [FP-PG-TSSLP-2-MFG]
D161  ESD  [FP-PG-TSSLP-2-MFG]
D162  ESD  [FP-PG-TSSLP-2-MFG]
D163  ESD  [FP-PG-TSSLP-2-MFG]
D164  ESD  [FP-PG-TSSLP-2-MFG]
J161  Coaxial Connector  [HRS-U.FL-R-SMT_V]
J162  105017-0001  [USB-MICRO-B_V]
J170  693043020611  [693043020611]
L160  68nH  [FP-LQW18AN_00-MFG]
L161  39nH  [FP-LQW18AN_00-MFG]
MD160  SARA-R422-00B  [FP-SARA-R422-00B-MFG]  (parts A,B of 2)
R160  0 ohm  [RESC1005X40X25LL05T10]
R161  0 ohm  [RESC1005X40X25LL05T10]
R164  10k, 0402  [RESC1005X40X25ML05T05]
R165  4.7k, 0402  [RESC0402(1005)_L]
U160  LK112M15TR  [SOT23-5L_L]

### Ports
LTE_CTS (out, see PLWD_TOP_V3[3C], AllPins_Peripherals[3C]), LTE_DCD (out, see PLWD_TOP_V3[3D], AllPins_Peripherals[3C]), LTE_DSR (bidir, see PLWD_TOP_V3[3D], AllPins_Peripherals[3C]), LTE_DTR (in, see PLWD_TOP_V3[3D], AllPins_Peripherals[3C]), LTE_GPIO1 (bidir, see PLWD_TOP_V3[2C], AllPins_Peripherals[3D]), LTE_GPIO2 (bidir, see PLWD_TOP_V3[2C], AllPins_Peripherals[1C]), LTE_GPIO3 (bidir, see PLWD_TOP_V3[2C], AllPins_Peripherals[1C]), LTE_GPIO4 (bidir, see PLWD_TOP_V3[2C], AllPins_Peripherals[1C]), LTE_GPIO5/SIM_DETECT (out, see PLWD_TOP_V3[2D], AllPins_Peripherals[1C]), LTE_GPIO6 (bidir, see PLWD_TOP_V3[2D], AllPins_Peripherals[3D]), LTE_I2S_CLK (out, see PLWD_TOP_V3[2D], AllPins_Peripherals[1D]), LTE_I2S_RXD (out, see PLWD_TOP_V3[2D], AllPins_Peripherals[1D]), LTE_I2S_TXD (out, see PLWD_TOP_V3[2D], AllPins_Peripherals[1D]), LTE_I2S_WA (out, see PLWD_TOP_V3[2D], AllPins_Peripherals[1C]), LTE_IMC_ANT (bidir, see PLWD_TOP_V3[2D], AllPins_Peripherals[1D]), LTE_IMC_ANT_DET (out, see PLWD_TOP_V3[2D], AllPins_Peripherals[1D]), LTE_PWR_CTRL (out, see PLWD_TOP_V3[3D], AllPins_Peripherals[3D]), LTE_RI (out, see PLWD_TOP_V3[3D], AllPins_Peripherals[3C]), LTE_RTS (in, see PLWD_TOP_V3[3C], AllPins_Peripherals[3C]), LTE_RXD (out, see PLWD_TOP_V3[3C], AllPins_Peripherals[3D]), LTE_SCL (bidir, see PLWD_TOP_V3[3D], AllPins_Peripherals[1C]), LTE_SDA (bidir, see PLWD_TOP_V3[3D], AllPins_Peripherals[1C]), LTE_SIM_CLK (out, see PLWD_TOP_V3[2D], AllPins_Peripherals[1D]), LTE_SIM_IO (bidir, see PLWD_TOP_V3[2D], AllPins_Peripherals[1D]), LTE_SIM_RST (out, see PLWD_TOP_V3[2D], AllPins_Peripherals[1D]), LTE_TXD (in, see PLWD_TOP_V3[3C], AllPins_Peripherals[3C]), LTE_USB_5V0 (see PLWD_TOP_V3[3D], AllPins_Peripherals[3D]), LTE_USB_D+ (bidir, see PLWD_TOP_V3[2D], AllPins_Peripherals[1C]), LTE_USB_D- (bidir, see PLWD_TOP_V3[2D], AllPins_Peripherals[1C]), LTE_V_INT (out, see PLWD_TOP_V3[3D], AllPins_Peripherals[3C]), LTE_VSIM (out, see PLWD_TOP_V3[2D], AllPins_Peripherals[1D]), MCU_LTE_PWR_CTRL (in, see PLWD_TOP_V3[3D], MCU_STM32_L496ZGT6[1D])

### Nets
AGND: ANT1.2(GROUND)
GND: C160.1 C161.1 C162.1 C163.1 C164.1 C167.1 C168.2 C169.2 D160.1 D161.1 D162.1 D163.1 D164.1 J161.1(GND) J161.2(GND) J162.5(GND) J162.6(SHLD1) J162.7(SHLD2) J162.8(SHLD3) J162.9(SHLD4) J162.10(SHLD5) J162.11(SHLD6) J170.C5(GND) L161.1 MD160.1(GND) MD160.3(GND) MD160.5(GND) MD160.14(GND) MD160.20(GND) MD160.21(GND) MD160.22(GND) MD160.30(GND) MD160.32(GND) MD160.43(GND) MD160.50(GND) MD160.54(GND) MD160.55(GND) MD160.57(GND) MD160.58(GND) MD160.59(GND) MD160.60(GND) MD160.61(GND) MD160.63(GND) MD160.64(GND) MD160.65(GND) MD160.66(GND) MD160.67(GND) MD160.68(GND) MD160.69(GND) MD160.70(GND) MD160.71(GND) MD160.72(GND) MD160.73(GND) MD160.74(GND) MD160.75(GND) MD160.76(GND) MD160.77(GND) MD160.78(GND) MD160.79(GND) MD160.80(GND) MD160.81(GND) MD160.82(GND) MD160.83(GND) MD160.84(GND) MD160.85(GND) MD160.86(GND) MD160.87(GND) MD160.88(GND) MD160.89(GND) MD160.90(GND) MD160.91(GND) MD160.92(GND) MD160.93(GND) MD160.94(GND) MD160.95(GND) MD160.96(GND) U160.2(GND)
VDD: C168.1 C169.1 MD160.2(USB_3V3) MD160.51(VCC) MD160.52(VCC) MD160.53(VCC) R165.2 U160.1(SHDN)  [project net VDD_MCU]
1V8: MD160.4(V_INT) ; port LTE_V_INT
IMC_ANT: C165.2 MD160.56(ANT) ; port LTE_IMC_ANT
IMP_ANT_DET: MD160.62(ANT_DET) R164.2 ; port LTE_IMC_ANT_DET
LTE_CTS: MD160.11(CTS) ; port LTE_CTS
LTE_DCD: MD160.8(DCD) ; port LTE_DCD
LTE_DSR: MD160.6(DSR) ; port LTE_DSR
LTE_DTR: MD160.9(DTR) ; port LTE_DTR
LTE_GPIO1: MD160.16(GPIO1) ; port LTE_GPIO1
LTE_GPIO2: MD160.23(GPIO2) ; port LTE_GPIO2
LTE_GPIO3: MD160.24(GPIO3) ; port LTE_GPIO3
LTE_GPIO4: MD160.25(GPIO4) ; port LTE_GPIO4
LTE_GPIO6: MD160.19(GPIO6) ; port LTE_GPIO6
LTE_I2S_CLK: MD160.36(I2S_CLK) ; port LTE_I2S_CLK
LTE_I2S_RXD: MD160.37(I2S_RXD) ; port LTE_I2S_RXD
LTE_I2S_TXD: MD160.35(I2S_TXD) ; port LTE_I2S_TXD
LTE_I2S_WA: MD160.34(I2S_WA) ; port LTE_I2S_WA
LTE_RI: MD160.7(RI) ; port LTE_RI
LTE_RTS: MD160.10(RTS) ; port LTE_RTS
LTE_RXD: MD160.13(RXD) R165.1 ; port LTE_RXD
LTE_SCL: MD160.27(SCL) ; port LTE_SCL
LTE_SDA: MD160.26(SDA) ; port LTE_SDA
LTE_SIM_CLK: C161.2 D162.2 J170.C3(CLOCK) MD160.38(SIM_CLK) ; port LTE_SIM_CLK
LTE_SIM_IO: C162.2 D163.2 J170.C7(I/O) MD160.39(SIM_IO) ; port LTE_SIM_IO
LTE_SIM_RST: C160.2 D161.2 J170.C2(RESET) MD160.40(SIM_RST) ; port LTE_SIM_RST
LTE_TXD: MD160.12(TXD) ; port LTE_TXD
LTE_USB_5V0: MD160.17(USB_5V0) ; port LTE_USB_5V0
LTE_USB_DM: J162.2(D-) MD160.28(USB_D-) ; port LTE_USB_D-  [project net LTE_USB_D-]
LTE_USB_DP: J162.3(D+) MD160.29(USB_D+) ; port LTE_USB_D+  [project net LTE_USB_D+]
LTE_VSIM: C163.2 C164.2 D164.2 J170.C1(VCC) MD160.41(VSIM) ; port LTE_VSIM
MCU_LTE_PWR_CTRL: U160.5(IN) ; port MCU_LTE_PWR_CTRL
PWR_CTRL: MD160.15(PWR_CTRL) U160.4(OUT) ; port LTE_PWR_CTRL  [project net LTE_PWR_CTRL]
SIM_DETECT: MD160.42(GPIO5) ; port LTE_GPIO5/SIM_DETECT  [project net LTE_GPIO5/SIM_DETECT]
NetANT1_3: ANT1.3(FEEDING) R160.2
NetC165_1: C165.1 C166.2 L161.2
NetC166_1: C166.1 L160.2 R160.1 R161.1
NetC167_2: C167.2 D160.2 L160.1 R164.1
NetJ161_3: J161.3(SIG) R161.2

Not connected (* = marked no-connect by the designer): ANT1 1(1_FIXING_PAD) 4(2_FIXING_PAD); J162 1(VBUS) 4(ID)*; J170 C6(VPP) Shell(Shield); MD160 18(RESERVED) 31(ANT_GNSS)* 33(RESERVED) 44(ANT_ON)* 45(TIMEPULSE)* 46(EXTINT)* 47(TXD_GNSS)* 48(RESERVED) 49(RESERVED); U160 3(BYP)

### Layout directives
mark named DIFFPAIR 90ohm: LTE_USB_D+, LTE_USB_D-

### Notes on the sheet
- SCL and SDA pins come with internal pull up resistors, according to LTE SARA datasheet
- RTS has active pull up to V_INT
- External SIM card detection interrupt (1=present)
- The TXD pin has an internal active pull up, so no external resistor needed
- (near C160) Note: According to the datasheet, the 'EXTINT' pin should not exist for this model. Not sure why it is here.

### Library data of the parts
ANT1 = CMP-04721-000002-1: RF ANT 829MHZ/2.2GHZ CHIP SLD; Manufacturer: Molex; Number Of Bands: 2; Gain: 3.8dB; Max Frequency: 2700MHz; Bandwidth: 280/990MHz; Return Loss: -5dB; Automotive: No; ComponentLink2URL: https://www.molex.com/webdocs/datasheets/pdf/en-us/1462000001_ANTENNAS.pdf; Device Class L1: Integrated Circuits (ICs); RoHS: TRUE; Footprint Url: https://www.molex.com/pdm_docs/sd/1462000001_sd.pdf; Device Class L3: RF Antennas; Height: 5.3mm; Package: 146200-0001; Manufacturer Part Number: 146200-0001; Category: Ant; ComponentLink2Description: Datasheet; Digikey Description: RF ANT 829MHZ/2.2GHZ CHIP SLD; Device Class L2: RF Semiconductors and Devices; Mouser Description: Antenna; RF; 3.8dBi; f: 1710÷2700MHz, 698÷960MHz; Mounting: SMD; Lead Free: Yes; Octopart: https://octopart.com/146200-0001-molex-75347041
C160-C163 = CMP-2006-03321-2: CAP CER 47PF 100V 5% NP0; Manufacturer: KEMET; Manufacturer Part Number: C0603C470J1GACTU; Temperature Characteristic: C0G; Temperature Coefficient: 30ppm/°C; Automotive Grade: Grade 1; Material: Ceramic; Tolerance: 0.05; Digikey Description: CAP CER 47PF 100V 5% NP0 0603; Value: 47 pF; Category: Cap; Device Class L2: Capacitors; Device Class L1: Passive Components; Package: C0603C-CF; Octopart: https://octopart.com/c0603c470j1gactu-kemet-3768219; Lead Free: Yes; Temperature Range High: +125°C; Device Class L3: Ceramic Capacitors; Height: 0.87mm; Temperature: -55°C to +125°C; Mouser Description: Multilayer Ceramic Capacitors MLCC - SMD/SMT 100volts 47pF C0G 5%; Automotive: Yes; Capacitance: 47 pF; RoHS: TRUE; ComponentLink2URL: https://api.kemet.com/component-edge/download/datasheet/C0603C100J5GACAUTO.pdf; Voltage Rating: 100 V; ComponentLink2Description: Datasheet; Temperature Range Low: -55°C
C164 C168 C169 = CMP-001-00001-6: as C100 on sheet MCU_STM32_L496ZGT6; Min Operating Temperature: -55°C; Pins: 2; Case/Package: 0402; Max Operating Temperature: 125°C; Mounting Technology: SM; RoHS Compliant: True; Tolerance: 5%
C165 = CMP-04427-007118-1: General Purpose Ceramic Capacitor, 0603, 15pF, 1%, NP0, 30ppm/°C, 50V; Dielectric: C0G; Case Code (Metric): 1608; Mount: Surface Mount; Thickness: 0.035inch; Width: 0.032inch; Package Quantity: 4000; Packaging: Tape and Reel; Capacitance: 15pF; Length: 1.6mm; Case/Package: 0603; Voltage Rating (DC): 50V; Construction: Flat; Min Operating Temperature: -55°C; Radiation Hardening: No; RoHS Compliant: Yes; Tolerance: 1%; Series: 0603; Case Code (Imperial): 0603; Depth: 0.81mm; Max Operating Temperature: 125°C; Voltage Rating: 50V; Termination: SMD/SMT
C166 = CMP-2006-04030-1: Manufacturer: AVX Interconnect / Elco; Part Number: 06031A330FAT2A
C167 = CMP-2006-03479-2: CAP CER 27PF 50V 1% NP0 0603; Manufacturer: KEMET; Manufacturer Part Number: C0603C270F5GACTU; Automotive Grade: Grade 1; Temperature Coefficient: 30ppm/°C; Tolerance: 0.01; Temperature Characteristic: C0G; Material: Ceramic; Temperature: -55°C to +125°C; ComponentLink2URL: https://api.kemet.com/component-edge/download/datasheet/C0603C100J5GACAUTO.pdf; Category: Cap; Device Class L1: Passive Components; Mouser Description: Multilayer Ceramic Capacitors MLCC - SMD/SMT 50volts 27pF C0G 1%; Lead Free: Yes; Device Class L2: Capacitors; Digikey Description: CAP CER 27PF 50V 1% NP0 0603; Voltage Rating: 50 V; Value: 27 pF; Automotive: Yes; Temperature Range Low: -55°C; Device Class L3: Ceramic Capacitors; Height: 0.87mm; Package: C0603C-CF; RoHS: TRUE; ComponentLink2Description: Datasheet; Octopart: https://octopart.com/c0603c270f5gactu-kemet-9143570; Capacitance: 27 pF; Temperature Range High: +125°C
D160-D164 = CMP-32928-000008-1: TVS DIODE 5.5V 30V TSSLP-2-4; Power Line Protection: No; Element Configuration: Single; Number of Bidirectional Channels: 1; Min Breakdown Voltage: 7.3V; Capacitance: 0.2pF; Direction: Bidirectional; Leakage Current: 50nA; Peak Pulse Current: 2A; Composition: Zener; Case/Package: SMD/SMT; Max Operating Temperature: 125°C; Working Voltage: 5.5V; Packaging: Tape and Reel; Length: 0.62mm; Reverse Standoff Voltage: 5.5V; Clamping Voltage: 30V; Min Operating Temperature: -55°C; Lead Free: Lead Free; Halogen Free: Halogen Free; Mount: Surface Mount; Radiation Hardening: No; Package Quantity: 15000; Depth: 0.32mm; Number of Pins: 2
J161 = CMP-002-00035-2: Ultra Small Surface Mount Coaxial Connector, 50 Ohm, -40 to 90 degC, 3-Pin SMD, RoHS, Tape and Reel; Manufacturer: Hirose Electric; Impedance: 50Ohm; Connector Type: RF&Coax; Max Operating Temperature: 90°C; Contact Material: Brass; Packaging: TapeandReel; Mounting Technology: SM; Package Quantity: 2500; Min Operating Temperature: -40°C; Contact Plating: Gold; RoHS Compliant: True; Datasheet Version: Aug-16; Package Description: 3-Pin Surface Mount Device, Body 2.6 x 2.6 mm; Datasheet URL: https://www.hirose.com/product/en/download_file/key_name/U.FL/category/Catalog/doc_file_id/31697/?file_category_id=4&item_id=15&is_series=1; Package Reference: U.FL-R-SMT; Fastening Type: Snap; Resistance: 50Ohm; Manufacturer URL: https://www.hirose.com; Case/Package: U.FL-R-SMT
J162 = CMP-2000-05827-1: Micro-USB B Receptacle, Right Angle, Bottom Mount, Surface Mount, with Solder Tabs, -30 to 85 degC, 5-Pin USB, RoHS, Tape and Reel; Manufacturer: Molex; Featured Product: Micro-USBConnectorsUSBConnectors; Other Names: WM1399DKR; Package Version: Rev. F, 12/2012; Number of Contacts: 5; Connector Type: USB-microB; Catalog Drawings: 1050170001; 3D Model: 105017-0001.stp; Mating Products: WM17145-ND-CABLEMICROUSBBTOSTDA1.0MWM17147-ND-CABLEMICROUSBBTOSTDA2.0MWM17146-ND-CABLEMICROUSBBTOSTDA1.5M; PCN Assembly/Origin: ResinSupplier21/Oct/2015; Voltage - Max: 30V; Online Catalog: Molex-MicroUSB; Manufacturer URL: http://www.molex.com/; Package Description: 5-Leads USB, Micro B, Body 7.5 x 5 mm, Pitch 0.65 mm; Datasheet URL: http://www.molex.com/elqNow/elqRedir.htm?ref=http://www.molex.com/webdocs/datasheets/pdf/en-us/1050170001_IO_CONNECTORS.pdf; Ingress Protection: -; Datasheet Version: 03/2016; Mounting Type: BoardCutout,SurfaceMount,RightAngle; Circuits: 5; Standard Package: 1; Package Reference: MICRO-B; Package URL: http://www.molex.com/pdm_docs/sd/1050170001_sd.pdf; Category: Connectors,Interconnects; Series: -; RoHS Information: 1050170001CertofCompliance; Features: Shielded,SolderRetention; Family: USB,DVI,HDMIConnectors; Specifications: -; Gender: Receptacle; Packaging: Digi-Reel®; Mounting Technology: SurfaceMount
J170 = CMP-1502-00157-2: NexarPartId: 52645179; Number of Positions: 6; Insulation Resistance: 500MΩ; Current Rating: 1A; Operating Supply Voltage: 15V; Connector Type: Connector; Number of Pins: 6; Min Operating Temperature: -25°C; Height: 1.3mm; RoHS: Compliant; Features: Shielded; Mount: Surface Mount; Voltage Rating: 15V; Contact Material: Gold; Contact Plating: Gold; REACH SVHC: Unknown; Lead Free: Lead Free; Number of Contacts: 6; Packaging: Tape and Reel; Max Operating Temperature: 85°C
L160 = CMP-06042-005646-1: Wire Wound RF Inductor 68nH ±2% 340mA 0.38Ω 0603 (1608); Q Factor: 38; Shielding: Unshielded; Series Resistance: 380mR; Test Frequency: 100MHz; Core Material: Non-Magnetic; Self Resonant Frequency: 2.2GHz; Current: 220mA; Number of Pins: 2; Height: 0.8mm; Height - Seated (Max): 0.039inch; Max DC Current: 340mA; Inductance: 68nH; Tolerance: 2%; Packaging: Tape and Reel; Mount: Surface Mount; Lead Free: Lead Free; Width: 0.8mm; Case/Package: 0603; DC Current: 340mA; Depth: 1mm; Min Operating Temperature: -55°C; Military Standard: Not; Package Quantity: 1; REACH SVHC: No SVHC; Length: 1.6mm; DC Resistance (DCR): 380mR; Current Rating: 340mA; Weight: 0.000106oz; Inductance Tolerance: 2%; Max Operating Temperature: 125°C; Termination: SMD/SMT; Case Code (Metric): 1608; Case Code (Imperial): 0603; Resistor Type: Wirewound
L161 = CMP-06042-008736-1: Wire Wound RF Inductor 39nH ±2% 400mA 0.26Ω 0603 (1608); Core Material: Non-Magnetic; Test Frequency: 100MHz; Shielding: Unshielded; Q Factor: 40; Self Resonant Frequency: 2.8GHz; Current: 370mA; DC Resistance (DCR): 260mR; Package Quantity: 4000; Case/Package: 0603; Resistor Type: Wirewound; Height - Seated (Max): 0.039inch; Lead Free: Lead Free; Min Operating Temperature: -55°C; Case Code (Imperial): 0603; Radiation Hardening: No; Max Operating Temperature: 125°C; Military Standard: Not; Depth: 1mm; Height: 0.8mm; Inductance: 39nH; Case Code (Metric): 1608; Termination: SMD/SMT; Current Rating: 400mA; Max DC Current: 400mA; Tolerance: 2%; Width: 0.031inch; Series Resistance: 260mR; Weight: 0.000106oz; DC Current: 400mA; Length: 1.6mm; Packaging: Tape and Reel; Mount: Surface Mount
MD160 = CMP-207130-000019-1: RF TXRX CELL 4G LTE NB-IOT EGPRS
R160 R161 = CMP-2002-06455-1: as R102 on sheet MCU_STM32_L496ZGT6
R164 = CMP-009-00015-5: as R101 on sheet MCU_STM32_L496ZGT6; Case/Package: 0402; Value: 10k; RoHS Compliant: True; Min Operating Temperature: -55°C; Mounting Technology: SM; Tolerance: 1%; Max Operating Temperature: 155°C; Pins: 2
R165 = CMP-009-00158-3: as R100 on sheet MCU_STM32_L496ZGT6; Max Operating Temperature: 155°C; Pins: 2; Value: 4.7k; Min Operating Temperature: -55°C; Case/Package: 0402
U160 = CMP-0244-00381-1: Low Noise Low Drop Voltage Regulator with Shutdown Function, 1.5V, 5-Pin SOT23-5L, Tape and Reel; ComponentLink2Description: Datasheet; DatasheetVersion: 28/02/2011; PackageReference: SOT23-5L; ComponentLink1Description: Manufacturer URL; PackageVersion: 1/01/2008; PackageDescription: 5-Pin SOT-23 Package, 2.9 x 1.6 mm Body, 0.95 mm Pitch, 2.8 mm Lead Span; ComponentLink1URL: http://www.st.com; ComponentLink2URL: http://www.st.com/internet/com/TECHNICAL_RESOURCES/TECHNICAL_LITERATURE/DATASHEET/CD00002190.pdf